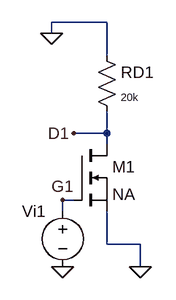
[diagram p0: schematic DifferentialAmplifierSmallSignalEqSingle.asc]
DifferentialAmplifierSmallSignalEqSingle.asc, the LTspice schematic file:
Version 4
SHEET 1 880 680
WIRE 256 -80 176 -80
WIRE 176 -64 176 -80
WIRE 256 -32 256 -80
WIRE 256 80 256 48
WIRE 256 80 208 80
WIRE 256 96 256 80
WIRE 208 176 192 176
WIRE 192 192 192 176
WIRE 256 240 256 192
WIRE 304 240 256 240
WIRE 304 272 304 240
FLAG 208 80 D1
FLAG 192 272 0
FLAG 192 176 G1
FLAG 176 -64 0
FLAG 304 272 0
SYMBOL nmos 208 96 R0
SYMATTR InstName M1
SYMATTR Value NA
SYMBOL res 240 -48 R0
WINDOW 3 36 76 Left 1
SYMATTR Value 20k
SYMATTR InstName RD1
SYMBOL voltage 192 176 M0
WINDOW 3 24 96 Invisible 2
SYMATTR InstName Vi1

The netlist it stands for:
* DifferentialAmplifierSmallSignalEqSingle.asc
M1 D1 G1 0 0 NA
RD1 0 D1 20k
Vi1 G1 0 V
.model NMOS NMOS
.model PMOS PMOS
.lib standard.mos
.backanno
.end